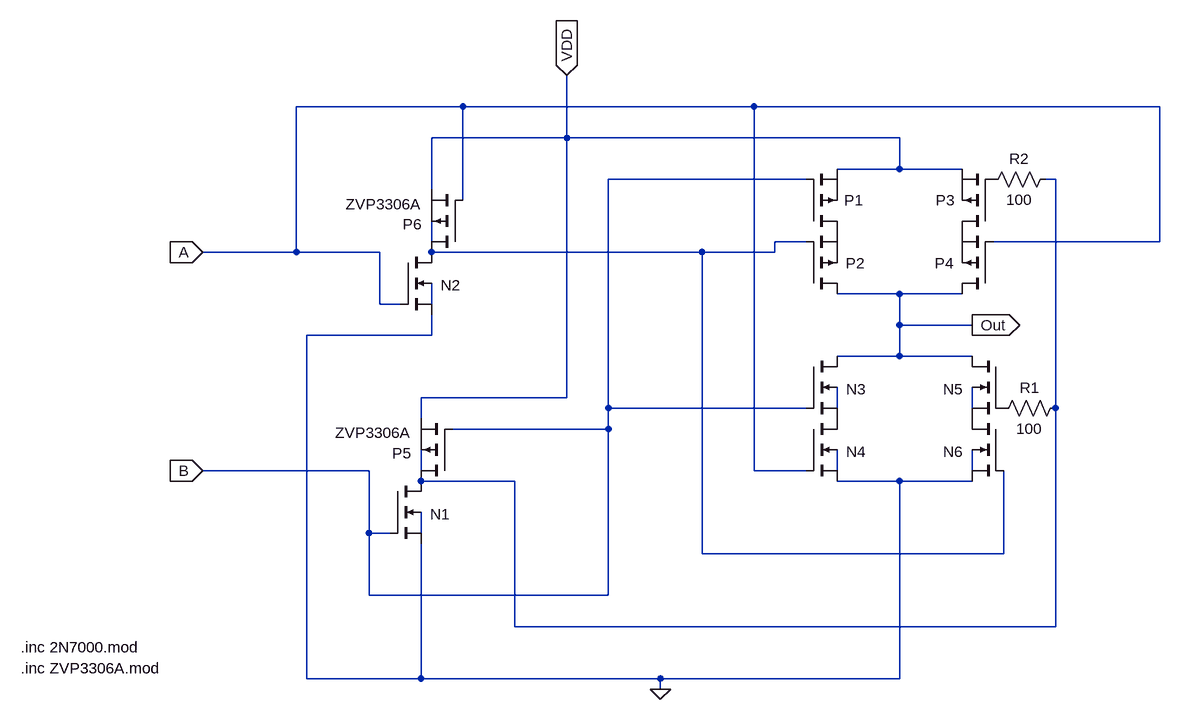
[diagram p0: schematic XOR.asc]
XOR.asc, the LTspice schematic file:
Version 4.1
SHEET 1 1140 708
WIRE 64 -208 -192 -208
WIRE 512 -208 64 -208
WIRE 1136 -208 512 -208
WIRE 224 -160 224 -256
WIRE 224 -160 16 -160
WIRE 736 -160 224 -160
WIRE 736 -112 736 -160
WIRE 736 -112 640 -112
WIRE 832 -112 736 -112
WIRE 592 -96 288 -96
WIRE 976 -96 960 -96
WIRE 16 -80 16 -160
WIRE 64 -64 64 -208
WIRE 16 0 16 -32
WIRE 592 0 544 0
WIRE 1136 0 1136 -208
WIRE 1136 0 880 0
WIRE -192 16 -192 -208
WIRE -192 16 -336 16
WIRE -64 16 -192 16
WIRE 432 16 16 16
WIRE 544 16 544 0
WIRE 544 16 432 16
WIRE 736 80 640 80
WIRE 832 80 736 80
WIRE -64 96 -64 16
WIRE -32 96 -64 96
WIRE 16 96 16 64
WIRE 736 128 736 80
WIRE 848 128 736 128
WIRE 16 144 16 112
WIRE 16 144 -176 144
WIRE 736 176 736 128
WIRE 736 176 640 176
WIRE 848 176 736 176
WIRE 224 240 224 -160
WIRE 224 240 0 240
WIRE 288 256 288 -96
WIRE 592 256 288 256
WIRE 640 256 640 224
WIRE 848 256 848 224
WIRE 976 256 976 -96
WIRE 0 272 0 240
WIRE 288 288 288 256
WIRE 288 288 48 288
WIRE -80 352 -336 352
WIRE 0 352 0 320
WIRE 512 352 512 -208
WIRE 592 352 512 352
WIRE 640 352 640 320
WIRE 848 352 848 320
WIRE 144 368 0 368
WIRE 736 368 640 368
WIRE 848 368 736 368
WIRE -80 448 -80 352
WIRE -48 448 -80 448
WIRE 0 448 0 416
WIRE 432 480 432 16
WIRE 896 480 896 352
WIRE 896 480 432 480
WIRE -80 544 -80 448
WIRE 288 544 288 288
WIRE 288 544 -80 544
WIRE 144 592 144 368
WIRE 976 592 976 256
WIRE 976 592 144 592
WIRE -176 672 -176 144
WIRE 0 672 0 464
WIRE 0 672 -176 672
WIRE 368 672 0 672
WIRE 736 672 736 368
WIRE 736 672 368 672
WIRE 368 688 368 672
FLAG 848 128 Out
IOPIN 848 128 Out
FLAG -336 352 B
IOPIN -336 352 In
FLAG -336 16 A
IOPIN -336 16 In
FLAG 224 -256 VDD
IOPIN 224 -256 In
FLAG 368 688 0
SYMBOL pmos 592 -16 M180
WINDOW 0 59 48 Left 2
WINDOW 3 56 72 Invisible 2
SYMATTR InstName P1
SYMATTR Value ZVP3306A
SYMATTR Prefix X
SYMBOL pmos 592 80 M180
WINDOW 0 61 47 Left 2
WINDOW 3 56 72 Invisible 2
SYMATTR InstName P2
SYMATTR Value ZVP3306A
SYMATTR Prefix X
SYMBOL pmos 880 -16 R180
WINDOW 0 59 48 Left 2
WINDOW 3 56 72 Invisible 2
SYMATTR InstName P3
SYMATTR Value ZVP3306A
SYMATTR Prefix X
SYMBOL pmos 880 80 R180
WINDOW 0 61 47 Left 2
WINDOW 3 56 72 Invisible 2
SYMATTR InstName P4
SYMATTR Value ZVP3306A
SYMATTR Prefix X
SYMBOL pmos 48 368 R180
WINDOW 0 63 43 Left 2
WINDOW 3 64 74 Left 2
SYMATTR InstName P5
SYMATTR Value ZVP3306A
SYMATTR Prefix X
SYMBOL pmos 64 16 R180
WINDOW 0 63 43 Left 2
WINDOW 3 64 74 Left 2
SYMATTR InstName P6
SYMATTR Value ZVP3306A
SYMATTR Prefix X
SYMBOL res 992 240 R90
WINDOW 0 0 56 VBottom 2
WINDOW 3 32 56 VTop 2
SYMATTR InstName R1
SYMATTR Value 100
SYMBOL res 976 -112 R90
WINDOW 0 0 56 VBottom 2
WINDOW 3 32 56 VTop 2
SYMATTR InstName R2
SYMATTR Value 100
SYMBOL nmos4 -48 368 R0
WINDOW 0 62 51 Left 2
WINDOW 3 56 72 Invisible 2
SYMATTR InstName N1
SYMATTR Value 2N7000
SYMATTR Prefix X
SYMBOL nmos4 -32 16 R0
WINDOW 0 62 51 Left 2
WINDOW 3 56 72 Invisible 2
SYMATTR InstName N2
SYMATTR Value 2N7000
SYMATTR Prefix X
SYMBOL nmos4 592 176 R0
WINDOW 0 62 51 Left 2
WINDOW 3 56 72 Invisible 2
SYMATTR InstName N3
SYMATTR Value 2N7000
SYMATTR Prefix X
SYMBOL nmos4 592 272 R0
WINDOW 0 62 51 Left 2
WINDOW 3 56 72 Invisible 2
SYMATTR InstName N4
SYMATTR Value 2N7000
SYMATTR Prefix X
SYMBOL nmos4 896 176 M0
WINDOW 0 62 51 Left 2
WINDOW 3 56 72 Invisible 2
SYMATTR InstName N5
SYMATTR Value 2N7000
SYMATTR Prefix X
SYMBOL nmos4 896 272 M0
WINDOW 0 62 51 Left 2
WINDOW 3 56 72 Invisible 2
SYMATTR InstName N6
SYMATTR Value 2N7000
SYMATTR Prefix X
TEXT -616 624 Left 2 !.inc 2N7000.mod
TEXT -616 656 Left 2 !.inc ZVP3306A.mod

The netlist it stands for:
* XOR.asc
X§P1 P001 B VDD ZVP3306A  ; pins D G S
X§P2 Out N003 P001 ZVP3306A  ; pins D G S
X§P3 P002 P003 VDD ZVP3306A  ; pins D G S
X§P4 Out A P002 ZVP3306A  ; pins D G S
X§P5 N001 B VDD ZVP3306A  ; pins D G S
X§P6 N003 A VDD ZVP3306A  ; pins D G S
R1 N001 P004 100
R2 N001 P003 100
X§N1 N001 B 0 N010 2N7000  ; pins D G S B
X§N2 N003 A 0 N004 2N7000  ; pins D G S B
X§N3 Out B P005 N005 2N7000  ; pins D G S B
X§N4 P005 A 0 N008 2N7000  ; pins D G S B
X§N5 Out P004 P006 N006 2N7000  ; pins D G S B
X§N6 P006 N003 0 N009 2N7000  ; pins D G S B
.inc 2N7000.mod
.inc ZVP3306A.mod
.backanno
.end